# EAGLE design nrf51822 (EAGLE 7.2.0)
CNAME: BLEoT; CREVISION: 1.2; DESIGNER: Mohammed Aljarrah
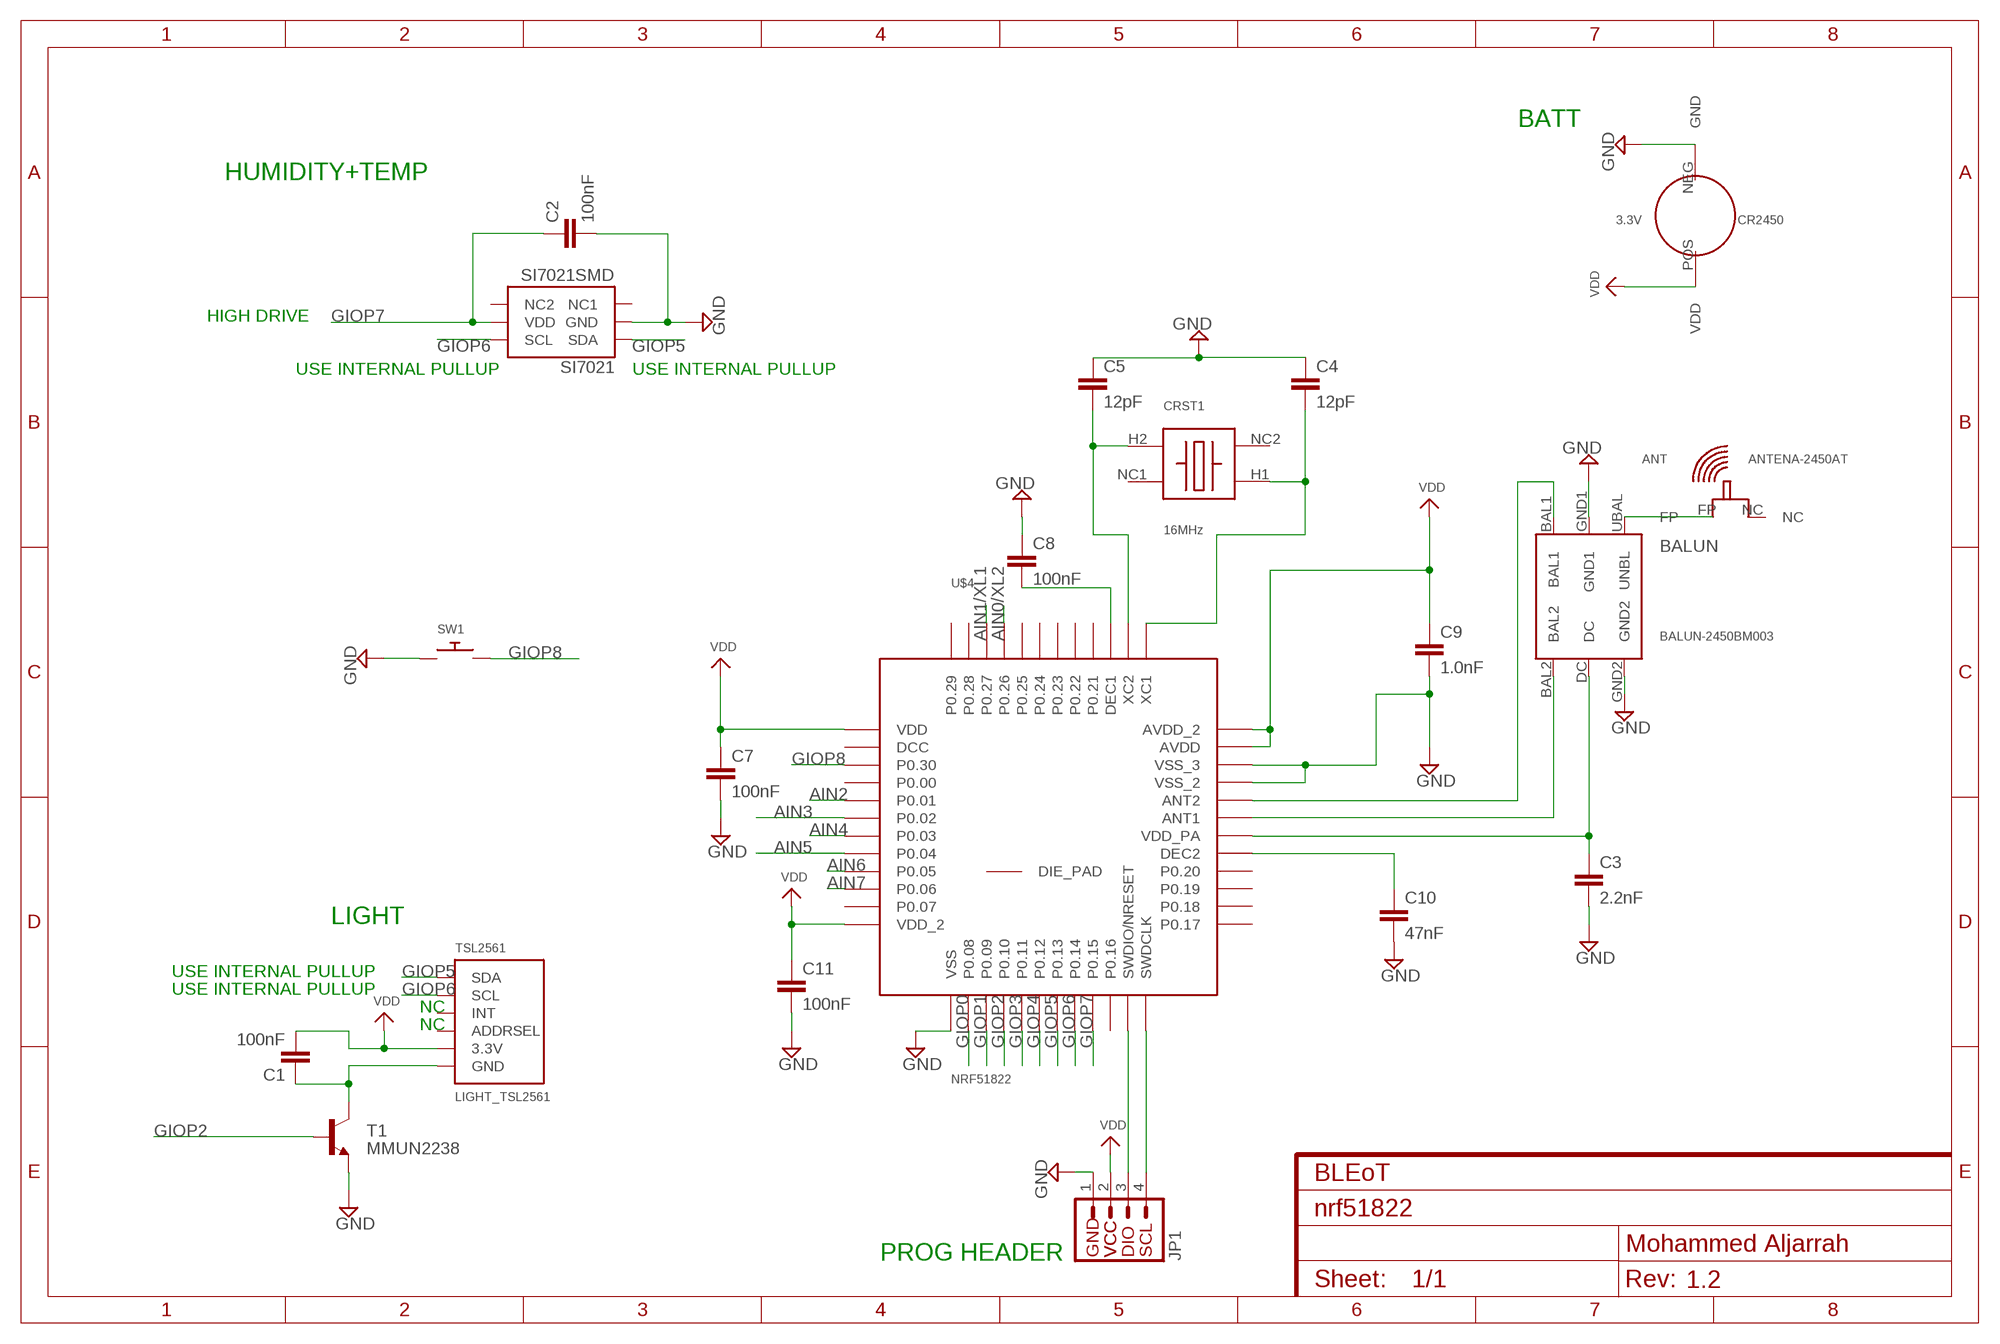
[diagram p0: schematic, sheet 1]

## Parts
ANT  ANTENA-2450AT  [2450AT18B100]
BALUN  BALUN-2450BM003  [2450BM14E0003]
C1  100nF  C-EUC0805  [C0805]
C2  100nF  C-EUC0805  [C0805]
C3  2.2nF  C-EUC0805  [C0805]
C4  12pF  C-EUC0805  [C0805]
C5  12pF  C-EUC0805  [C0805]
C7  100nF  C-EUC0805  [C0805]
C8  100nF  C-EUC0805  [C0805]
C9  1.0nF  C-EUC0805  [C0805]
C10  47nF  C-EUC0805  [C0805]
C11  100nF  C-EUC0805  [C0805]
CR2450  3.3V  CR2450  [CR2450]
CRST1  16MHz  CX3225GB  [CRYSTAL16MHZ]
JP1  PROG_HEADER  [1X04]
SI7021  SI7021SMD  [SI7021]
SW1  SWITCH_PUSHBUTTONSOFTTOUCHSMD_SJ  [PUSHBUTTON_SMD_SJ]
T1  MMUN2238  TRANSISTOR_NPNMMBT2222A  [SOT23-3]
TSL2561  LIGHT_TSL2561  [TSL2561_FN]
U$4  NRF51822  [QFN48]

## Nets
AIN0/XL2: U$4.45(P0.26)
AIN1/XL1: U$4.46(P0.27)
AIN2: U$4.5(P0.01)
AIN3: U$4.6(P0.02)
AIN4: U$4.7(P0.03)
AIN5: U$4.8(P0.04)
AIN6: U$4.9(P0.05)
AIN7: U$4.10(P0.06)
GIOP0: U$4.14(P0.08)
GIOP1: U$4.15(P0.09)
GIOP2: T1.1(B) U$4.16(P0.10)
GIOP3: U$4.17(P0.11)
GIOP4: U$4.18(P0.12)
GIOP5: SI7021.1(SDA) TSL2561.DATA(SDA) U$4.19(P0.13)
GIOP6: SI7021.6(SCL) TSL2561.CLK(SCL) U$4.20(P0.14)
GIOP7: C2.1 SI7021.5(VDD) U$4.21(P0.15)
GIOP8: SW1.P$2 U$4.3(P0.30)
GND: BALUN.GND1 BALUN.GND2 C2.2 C3.2 C4.1 C5.1 C7.2 C8.1 C9.2 C10.2 C11.2 JP1.1 SI7021.2(GND) SW1.P$1 T1.2(E) U$4.13(VSS) U$4.33(VSS_2) U$4.34(VSS_3)
N$1: C5.2 CRST1.H2 U$4.38(XC2)
N$2: C4.2 CRST1.H1 U$4.37(XC1)
N$3: ANT.FP BALUN.UBAL(UNBL)
N$4: BALUN.DC C3.1 U$4.30(VDD_PA)
N$5: C8.2 U$4.39(DEC1)
N$6: BALUN.BAL1 U$4.32(ANT2)
N$7: C1.1 T1.3(C) TSL2561.VSS(GND)
N$8: JP1.3 U$4.23(SWDIO/NRESET)
N$10: BALUN.BAL2 U$4.31(ANT1)
N$13: C10.1 U$4.29(DEC2)
N$14: JP1.4 U$4.24(SWDCLK)
VDD: C1.2 C7.1 C9.1 C11.1 JP1.2 TSL2561.VDD(3.3V) U$4.1(VDD) U$4.12(VDD_2) U$4.35(AVDD) U$4.36(AVDD_2)
Unconnected: ANT.NC CRST1.NC1 CRST1.NC2 SI7021.3(NC1) SI7021.4(NC2) TSL2561.ADR(ADDRSEL) TSL2561.INT U$4.2(DCC) U$4.4(P0.00) U$4.11(P0.07) U$4.22(P0.16) U$4.25(P0.17) U$4.26(P0.18) U$4.27(P0.19) U$4.28(P0.20) U$4.40(P0.21) U$4.41(P0.22) U$4.42(P0.23) U$4.43(P0.24) U$4.44(P0.25) U$4.47(P0.28) U$4.48(P0.29) U$4.GND(DIE_PAD)

## Notes on the sheet
- BATT
- HUMIDITY+TEMP
- HIGH DRIVE
- USE INTERNAL PULLUP | USE INTERNAL PULLUP
- LIGHT
- USE INTERNAL PULLUP
- USE INTERNAL PULLUP
- NC
- NC
- PROG HEADER

## Power pins joined to a net without a drawn wire
GND: CR2450.NEG(GND)
VDD: CR2450.POS(VDD)

## Library data of the parts
ANT = NordicSemi:ANTENA-2450AT: General Specifications: Part Number 2450AT18B100 Input Power 3W max. Frequency Range 2400 - 2500 Mhz Impedance 50 Ω Peak Gain 0.5 dBi typ. (XZ-V) Operating Temperature -40 to +85°C Average Gain -0.5 dBi typ. (XZ-V) Reel Quanity 3,000 Return Loss 9.5 dB min
BALUN = NordicSemi:BALUN-2450BM003: 2450BM14E0003 2.45GHz Impedance Matched Balun + Band Pass Filter: Optimized for Nordic's Chipset nRF51822 and nRF51422
C1-C5 C7-C11 = rcl:C-EU: CAPACITOR, European symbol
CR2450 = NordicSemi:CR2450: CR2450 Mouser Part No: 614-SMTU2450N-LF.TR Manufacturer Part No: SMTU2450N-LF.TR
CRST1 = NordicSemi:CX3225GB: Mouser: 581-CX3225GB16DHPQCC Manufacturer: CX3225GB16000D0HPQCC 16MHz 8pF +/-20ppm Features • Crystal unit for Consumer Products • Small and low profile 0.9mm max. (3.2×2.5×0.8mm) • Ceramic package • Reflow compatible
JP1 = NordicSemi:PROG_HEADER: SparkFun has standardized on a pinout for all I2C based sensor breakouts. This pinout allows I2C boards to be plugged directly into the headers on Arduino Uno compatible boards, and to be daisy chained easily.
SI7021 = NordicSemi:SI7021: Humidity and temp sensor Mouser Part No: 634-SI7021-A-GM Manufacturer Part No: Si7021-A10-GM
SW1 = microbuilder:SWITCH_PUSHBUTTON: Buttons SOFTTOUCHSMD_SJ - Soft touch temporary push button (Super Junk Akihabara) Compatible with SKPMANE010 [Mouser: 688-SKPMAN]
T1 = SparkFun-DiscreteSemi:TRANSISTOR_NPN: Generic NPN BJT MMBT2222A - TRANS-08049 (SOT-23, 1A 40V) MPSA42 - TRANS-09116 (SOT-23, 500mA 300V) MMBT5088LT1G - TRANS-11160 (SOT-23, 50 mA 30V) BC547 - COM-08928 <http://www.sparkfun.com/products/8928> (TO-92 45V 100mA) (1.Collector 2.Base 3.Emitter) 2N3904 - COM-00521 <http://www.sparkfun.com/products/521> (TO-92 40V 200mA) (1.Emitter 2.Base 3.Collector) P2N2222A - COM-12852 <http://www.sparkfun.com/products/12852> (TO-92 40V 600mA) (1.Collector 2.Base 3.Emitter); PROD_ID: TRANS-08049; VALUE: MMBT2222A
TSL2561 = microbuilder:LIGHT_TSL2561: TSL2561 Light-To-Digital Sensor Mouser Part Numbers: CS (obsolete): 856-TSL2561CS DFN (cheapest): 856-TSL2561FN
U$4 = NordicSemi:NRF51822: Bluetooth 4.0 Low Energy/2.4Ghz NORDIC SEMICONDUCTOR

## Net classes
0 default: width 0.152 mm, drill 0.508 mm, clearance 0.152 mm

## Board
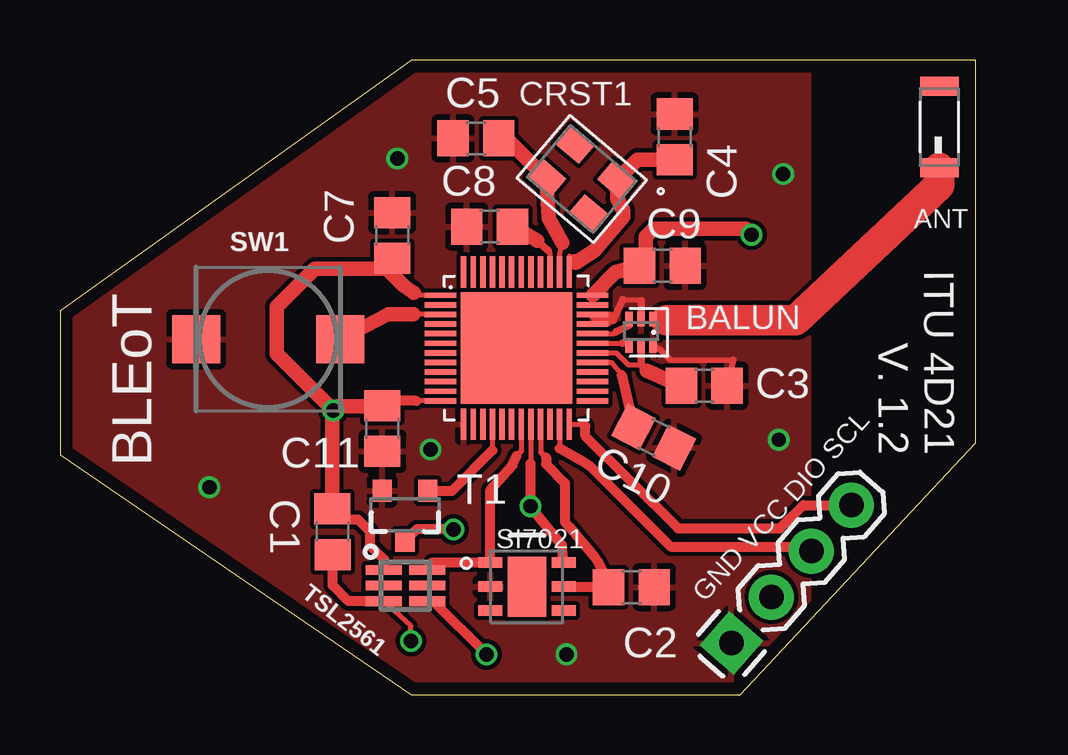
[diagram p1: board, top side]
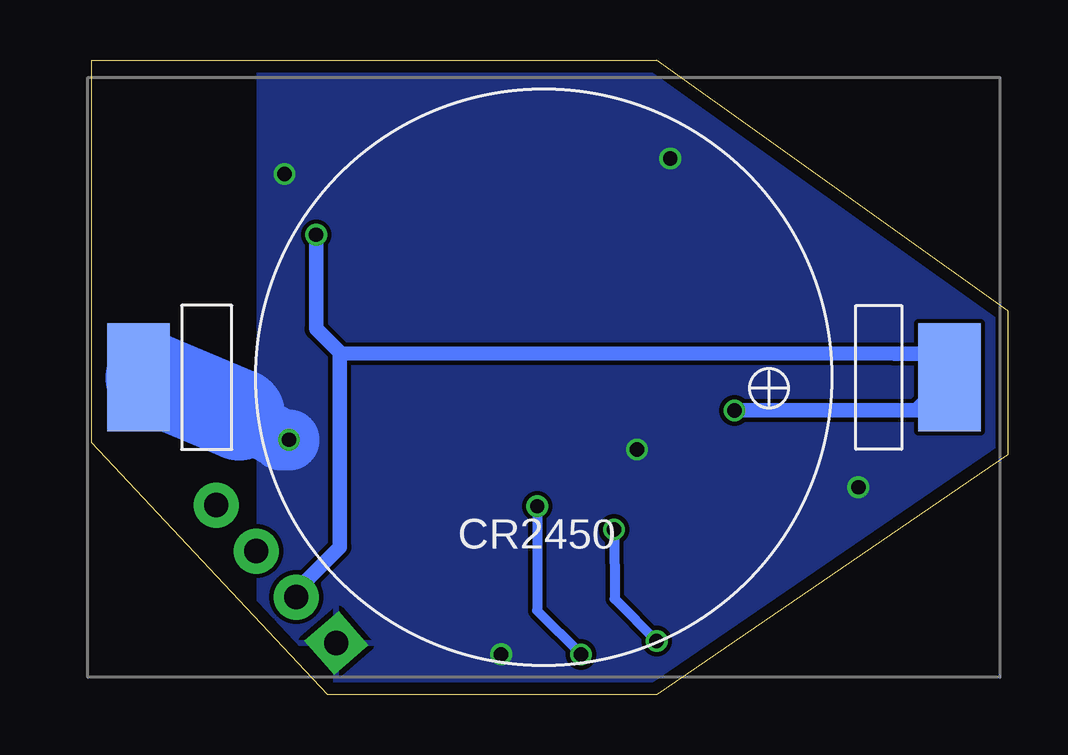
[diagram p2: board, bottom side, seen from below]

Size 38.16 x 26.44 mm. Coordinates in mm from the lower left corner, seen from the top.
Outline: 38.16,26.44 14.63,26.44 0,16 0,10 14.63,0 28.34,0 38.16,10.49 38.16,26.44
Copper layers (1*16): Top 0.035mm / dielectric 1.5mm / Bottom 0.035mm
Design rules "4D21": minimum track width 8mil, minimum drill 12mil, track to track 7mil, track to pad 6mil, pad to pad 6mil, via to via 7mil, smd to smd 0mil, copper to edge 20mil, drill to drill 10mil, minimum pad ring 10mil, minimum via ring 6mil, stop-mask expansion 2mil, vias tented up to drill 25mil, thermal gap 10mil

### Footprints (pad centres in the part's own frame; a part is rotated, then mirrored left to right if it is on the bottom)
2450AT18B100 = smd 0.8 x 1.6: FP -1.7,0; NC 1.7,0
2450BM14E0003 = smd 0.3 x 0.6: BAL1 0,0.05; BAL2 0,-1.05; DC 0.5,-1.05; GND1 0.5,0.05; GND2 1,-1.05; UBAL 1,0.05
C0805 = smd 1.3 x 1.5: 1 -0.95,0; 2 0.95,0
CR2450 = smd 2.6 x 4.5: NEG 16.9,0; POS -16.9,0
CRYSTAL16MHZ = smd 1.3 x 1.05: H1 -1.15,-0.925; H2 1.15,0.925; NC1 -1.15,0.925; NC2 1.15,-0.925
1X04 = drill 1.016 pad 1.88 square: 1 0,0 | drill 1.016 pad 1.88: 2 2.54,0; 3 5.08,0; 4 7.62,0
SI7021 = smd 1 x 0.45: 1 1.525,-1; 2 1.525,0; 3 1.525,1; 4 -1.525,1; 5 -1.525,0; 6 -1.525,-1 | smd 1.6 x 2.5: 7 0,0
PUSHBUTTON_SMD_SJ = smd 2 x 2: P$1 3,0; P$2 -3,0
SOT23-3 = smd 0.8 x 0.9: 1 -0.95,-1; 2 0.95,-1; 3 0,1.1
TSL2561_FN = smd 1.5 x 0.4: ADR -0.9,0; CLK 0.9,-0.65; DATA 0.9,0.65; INT 0.9,0; VDD -0.9,0.65; VSS -0.9,-0.65
QFN48 = smd 1.3 x 0.226: 1 -3.17,2.2; 2 -3.17,1.8; 3 -3.17,1.4; 4 -3.17,1; 5 -3.17,0.6; 6 -3.17,0.2; 7 -3.17,-0.2; 8 -3.17,-0.6; 9 -3.17,-1; 10 -3.17,-1.4; 11 -3.17,-1.8; 12 -3.17,-2.2; 25 3.17,-2.2; 26 3.17,-1.8; 27 3.17,-1.4; 28 3.17,-1; 29 3.17,-0.6; 30 3.17,-0.2; 31 3.17,0.2; 32 3.17,0.6; 33 3.17,1; 34 3.17,1.4; 35 3.17,1.8; 36 3.17,2.2 | smd 0.226 x 1.3: 13 -2.2,-3.17; 14 -1.8,-3.17; 15 -1.4,-3.17; 16 -1,-3.17; 17 -0.6,-3.17; 18 -0.2,-3.17; 19 0.2,-3.17; 20 0.6,-3.17; 21 1,-3.17; 22 1.4,-3.17; 23 1.8,-3.17; 24 2.2,-3.17; 37 2.2,3.17; 38 1.8,3.17; 39 1.4,3.17; 40 1,3.17; 41 0.6,3.17; 42 0.2,3.17; 43 -0.2,3.17; 44 -0.6,3.17; 45 -1,3.17; 46 -1.4,3.17; 47 -1.8,3.17; 48 -2.2,3.17 | smd 4.66 x 4.66: GND 0,0

### Placement (x,y rotation side)
ANT  36.64,23.65 90 top
BALUN  23.71,15.6 0 top
C1  11.36,6.78 90.3 top
C2  23.81,4.48 0 top
C3  26.85,12.87 0 top
C4  25.61,23.24 270 top
C5  17.33,23.18 0 top
C7  13.84,19.13 90 top
C8  17.9,19.5 0 top
C9  25.1,17.87 0 top
C10  24.74,10.72 333 top
C11  13.43,11.09 270 top
CR2450  19.32,13.22 180 bottom
CRST1  21.74,21.48 139.8 top
JP1  27.97,2.14 49 top
SI7021  19.46,4.5 180 top
SW1  8.67,14.81 180 top
T1  14.37,7.49 180 top
TSL2561  14.39,4.54 0 top
U$4  19.02,14.44 0 top

### Tracks (layer width: path | path; a pad name or v marks a point on that pad's centre or on a via)
GIOP2
  Top 0.203: U$4.16 18.02,10.18 | 15.33,8.48 T1.1
  Top 0.406: 18.02,10.18 16.32,8.48 15.33,8.48
GIOP5
  Top 0.203: U$4.19 19.22,10.13 19.03,9.94
  Top 0.406: TSL2561.DATA 15.5,5.5 SI7021.1 17.93,8.53 18.85,9.55 19.03,9.94
GIOP6  (via drill 0.6)
  Top 0.203: U$4.20 19.62,9.64 19.6,9.62
  Top 0.406: 19.6,9.62 v19.6,7.85 20.91,6.24 SI7021.6 | TSL2561.CLK 15.55,3.89 v17.77,1.67
  Bottom 0.406: v19.6,7.85 19.6,3.5 v17.77,1.67
GIOP7
  Top 0.203: U$4.21 20.03,11.26 20.03,10.1
  Top 0.254: 20.03,10.1 20.25,9.88
  Top 0.406: 22.75,4.49 22.74,4.5 SI7021.5 22.83,4.5 C2.1 22.92,4.54 22.41,5.54 22.28,5.71 21.19,7.01 21.04,7.19 21.04,8.81 20.25,9.6 20.25,9.88
GIOP8
  Top 0.203: U$4.3 14.4,15.84 14.72,15.85
  Top 0.61: 14.72,15.85 13.67,15.85 SW1.P$2
GND  (via drill 0.6)
  Top 0.203: 22.88,15.74 22.2,15.79 | 23.45,16.46 24.21,16.46 24.22,16.41 | 24.22,15.48 BALUN.GND1 | 22.28,15.57 U$4.34
  Top 0.254: BALUN.GND2 25.02,14.37 25.45,13.94 28.06,13.96 C3.2 | 22.61,15.54 22.28,15.57
  Top 0.305: 22.2,15.79 23.05,15.61 23.45,16.46 | 24.22,16.41 24.22,15.48
  Top 0.406: 22.88,15.74 22.81,15.57 22.61,15.54
  Bottom 2.54: v29.95,10.62 30.28,10.62 32.01,11.66 | 35.67,13.21 CR2450.NEG
  Bottom 3.81: 32.01,11.66 35.67,13.21
  other vias: 14.06,22.34 6.22,8.64 21.1,1.68 30.13,21.69 15.44,10.21
  pour Top: 31.23,0.25 31.23,27.25 -0.37,27 -0.37,0
  pour Bottom: 31.18,0.23 31.18,27.23 -0.37,27 -0.37,0
N$1
  Top 0.203: 20.94,18.82 20.86,18.57 20.81,18.36 U$4.38
  Top 0.61: C5.2 18.6,23.18 CRST1.H2 20.36,19.85 20.94,18.82
N$2
  Top 0.203: U$4.37 21.22,18.27 21.42,18.06
  Top 0.61: C4.2 24.05,22.29 CRST1.H1 23.21,20.68 23.48,20.17 23.48,19.91 22.26,18.49 21.5,17.98 21.42,18.06
N$3
  Top 0.305: 25.3,15.6 24.71,15.52 BALUN.UBAL
  Top 1.27: ANT.FP 36.64,21.21 30.66,15.6 25.3,15.6 25.25,15.6
N$4
  Top 0.203: U$4.30 23.18,14.24 23.68,13.74 24.2,13.74 24.21,13.73
  Top 0.254: 24.45,13.48 24.48,13.56
  Top 0.305: BALUN.DC 24.21,13.73 24.45,13.48
  Top 0.406: C3.1 25.34,13.1
  Top 0.61: 25.34,13.1 24.45,13.48
N$5
  Top 0.203: U$4.39 20.42,18.42 20.34,18.5
  Top 0.305: 20.34,18.5 19.88,18.9 | 18.9,19.38 C8.2
  Top 0.61: 19.88,18.9 19.45,19.18 18.9,19.38
N$6
  Top 0.203: U$4.32 23.1,15.04 23.17,15.11
  Top 0.305: BALUN.BAL1 23.71,15.4 23.17,15.11
N$7  (via drill 0.6)
  Top 0.203: v14.62,2.23 14.62,2.86 TSL2561.VSS
  Top 0.406: 13.58,3.88 TSL2561.VSS 12.02,3.89 11.36,4.55 C1.1 | v16.4,6.88 14.86,6.88 T1.3
  Bottom 0.406: v16.4,6.88 16.38,3.98 v14.62,2.23
N$8
  Top 0.203: U$4.23 20.82,10.26
  Top 0.406: 20.82,10.26 21.73,9.75 22.09,9.52 25.44,6.17 30.88,6.17 JP1.3
N$10
  Top 0.203: U$4.31 23.44,14.64
  Top 0.305: BALUN.BAL2 23.68,14.72 23.44,14.64
N$13
  Top 0.203: U$4.29 22.97,13.84 23.4,13.31 | 23.91,11.14 C10.1
  Top 0.406: 23.4,13.31 23.91,11.14
N$14
  Top 0.203: 21.84,11.25 21.24,11.25 U$4.24
  Top 0.406: 21.84,11.25 21.89,11.2 21.89,10.77 25.75,6.93 30,6.93 30.97,7.9 JP1.4
VDD  (via drill 0.6)
  Top 0.203: U$4.12 14.85,12.24 | U$4.1 14.64,16.64 14.75,16.74 | U$4.35 U$4.36
  Top 0.254: 24.41,17.42 C9.1
  Top 0.406: C7.1 13.72,17.75 | 14.85,12.24 13.63,12.24 C11.1 | TSL2561.VDD 13.49,5.64 12.94,6.2 12.94,6.78 12.43,7.29 11.79,7.29 C1.2
  Top 0.61: C11.1 13.4,12.01 11.55,12.01 v11.38,11.84 | 13.72,17.75 13.61,17.75 | 14.75,16.74 14.32,17.04 13.61,17.75 | C9.1 23.14,17.59 U$4.36 | 28.64,19.33 v28.81,19.16 28.56,19.41 24.75,19.41 24.41,19.07 24.41,17.42 | C1.2 11.35,11.81 v11.38,11.84 | 13.61,17.75 10.62,17.75 9.02,16.15 9.02,14.2 v11.38,11.84
  Bottom 0.406: 2.26,14.18 2.03,13.61 | 2.03,13.61 CR2450.POS | v28.8,19.15 v28.81,19.16 v28.82,19.15 | 2.64,14.21 2.03,13.61
  Bottom 0.61: 1.74,13.85 CR2450.POS 3.8,11.84 v11.38,11.84 | JP1.2 29.63,4.33 27.82,6.15 27.82,14.2 27.79,14.22 | 27.79,14.22 | 27.79,14.22 4.73,14.2 2.64,14.21 2.62,14.22 | v28.81,19.16 28.81,15.24 27.79,14.22

### Text on the board
tPlace: BLEoT | ITU 4D21 / V. 1.2 | GND VCC DIO SCL